# Altium schematic sheet CanFD.SchDoc: CanFD Components
size A4; ApprovedBy: Diogo Gomes; CheckedBy: Bruno, Candido, Pedro; Author: João Vieira; CompanyName: LART; DrawnBy: João Vieira; Organization: LART; Address1: Morro do lena; Address2: Alto Do Vieiro; Address3: APT 4163, Building D; Revision: v1.4.2; SheetNumber: 5; SheetTotal: 7; ProjectTitle: Autonomous Control Unit; CheckedBy1: G. Candido; CheckedBy2: F. Chen; CheckedBy3: P. Ferreira; CheckedBy4: B. Vicente; CheckedBy5: _; CheckedBy6: _; CheckedBy7: _; CHK_APP_DATE: --/--/--; DSN_APP_DATE: --/--/--; ENG_APP_DATE: --/--/--; Summary: Various CAN FD components; version_tag: 1.4.2; ImagePath: C:\Users\micron\Desktop
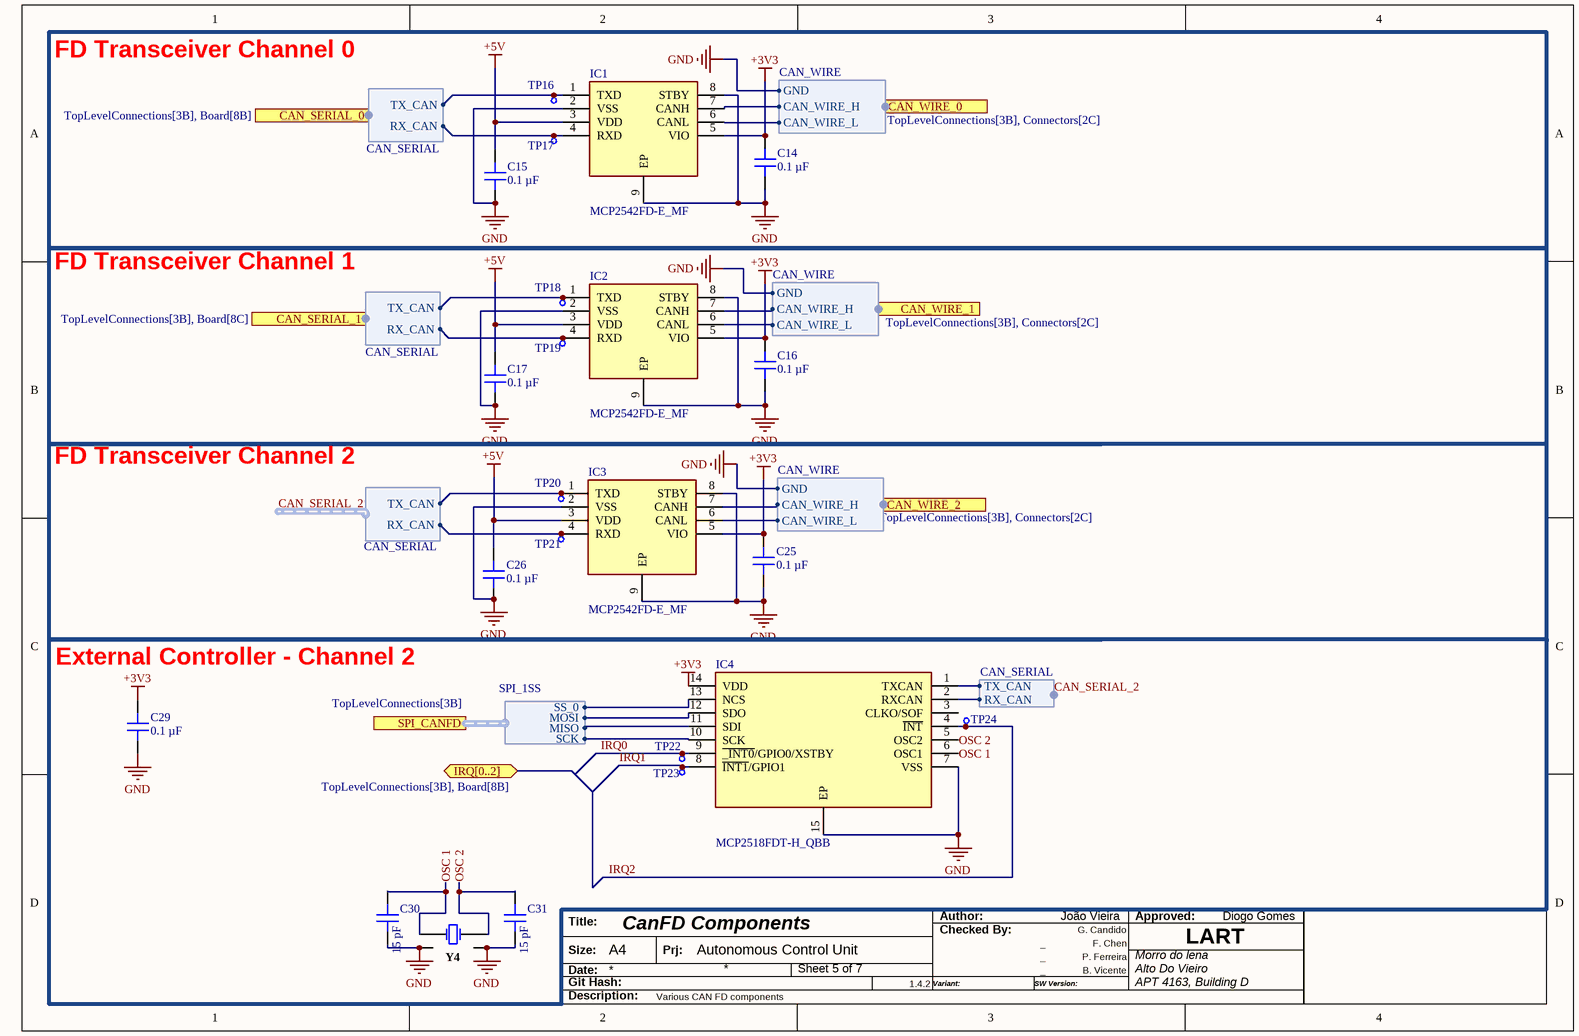
[diagram p0: CanFD.SchDoc]

## Parts
C14  value 0.1 µF  [CAP 0805_2012]  (hidden comment: 0.1uF)
C15  value 0.1 µF  [CAP 0805_2012]  (hidden comment: 0.1uF)
C16  value 0.1 µF  [CAP 0805_2012]  (hidden comment: 0.1uF)
C17  value 0.1 µF  [CAP 0805_2012]  (hidden comment: 0.1uF)
C25  value 0.1 µF  [CAP 0805_2012]  (hidden comment: 0.1uF)
C26  value 0.1 µF  [CAP 0805_2012]  (hidden comment: 0.1uF)
C29  0.1 µF  [CAP 0805_2012]
C30  15 pF  [CAP 0805_2012]
C31  15 pF  [CAP 0805_2012]
IC1  MCP2542FD-E_MF  [SON65P300X300X100-9N-D]
IC2  MCP2542FD-E_MF  [SON65P300X300X100-9N-D]
IC3  MCP2542FD-E_MF  [SON65P300X300X100-9N-D]
IC4  MCP2518FDT-H_QBB  [SON65P300X450X90-15N-D]
TP16  TestPad  [Test Pad Small]  (value not drawn)
TP17  TestPad  [Test Pad Small]  (value not drawn)
TP18  TestPad  [Test Pad Small]  (value not drawn)
TP19  TestPad  [Test Pad Small]  (value not drawn)
TP20  TestPad  [Test Pad Small]  (value not drawn)
TP21  TestPad  [Test Pad Small]  (value not drawn)
TP22  TestPad  [Test Pad Small]  (value not drawn)
TP23  TestPad  [Test Pad Small]  (value not drawn)
TP24  TestPad  [Test Pad Small]  (value not drawn)
Y4  ABM8-20.000MHZ-10-1-U-T  [FP-ABM8-MFG]  (value not drawn)

## Blocks framed on the sheet
FD Transceiver Channel 0: C14 C15 IC1 TP16 TP17
External Controller - Channel 2: C29-C31 IC4 TP22-TP24 Y4

## Ports
CAN_SERIAL_0 (harness CAN_SERIAL, see TopLevelConnections[3B], Board[8B]), CAN_SERIAL_1 (harness CAN_SERIAL, see TopLevelConnections[3B], Board[8C]), CAN_WIRE_0 (harness CAN_WIRE, see TopLevelConnections[3B], Connectors[2C]), CAN_WIRE_1 (harness CAN_WIRE, see TopLevelConnections[3B], Connectors[2C]), CAN_WIRE_2 (harness CAN_WIRE, see TopLevelConnections[3B], Connectors[2C]), IRQ[0..2] (bidir, see TopLevelConnections[3B], Board[8B]), SPI_CANFD (harness SPI_1SS, see TopLevelConnections[3B])

## Harnesses
CAN_SERIAL: RX_CAN, TX_CAN
CAN_WIRE: GND, CAN_WIRE_H, CAN_WIRE_L
SPI_1SS: MOSI, MISO, SS_0, SCK

## Nets
+3V3: C14.2 C16.2 C25.2 C29.2 IC1.5(VIO) IC2.5(VIO) IC3.5(VIO) IC4.14(VDD)
+5V: C15.2 C17.2 C26.2 IC1.3(VDD) IC2.3(VDD) IC3.3(VDD)
GND: C14.1 C15.1 C16.1 C17.1 C25.1 C26.1 C29.1 C30.1 C31.1 IC1.2(VSS) IC1.8(STBY) IC1.9(EP) IC2.2(VSS) IC2.8(STBY) IC2.9(EP) IC3.2(VSS) IC3.8(STBY) IC3.9(EP) IC4.7(VSS) IC4.15(EP) Y4.3 Y4.4 ; port CAN_WIRE_0.GND, port CAN_WIRE_1.GND, port CAN_WIRE_2.GND
CAN_SERIAL_2.RX_CAN: IC3.4(RXD) IC4.2(RXCAN) TP21.P2 ; harness CAN_SERIAL.RX_CAN
CAN_SERIAL_2.TX_CAN: IC3.1(TXD) IC4.1(TXCAN) TP20.P2 ; harness CAN_SERIAL.TX_CAN
IRQ0: IC4.9(~{_INT0}/GPIO0/XSTBY) TP22.P2
IRQ1: IC4.8(~{INT1}/GPIO1) TP23.P2
IRQ2: IC4.4(~{INT}) TP24.P2
OSC 1: C30.2 IC4.6(OSC1) Y4.1
OSC 2: C31.2 IC4.5(OSC2) Y4.2
NetIC1_1: IC1.1(TXD) TP16.P2 ; port CAN_SERIAL_0.TX_CAN
NetIC1_4: IC1.4(RXD) TP17.P2 ; port CAN_SERIAL_0.RX_CAN
NetIC1_6: IC1.6(CANL) ; port CAN_WIRE_0.CAN_WIRE_L
NetIC1_7: IC1.7(CANH) ; port CAN_WIRE_0.CAN_WIRE_H
NetIC2_1: IC2.1(TXD) TP18.P2 ; port CAN_SERIAL_1.TX_CAN
NetIC2_4: IC2.4(RXD) TP19.P2 ; port CAN_SERIAL_1.RX_CAN
NetIC2_6: IC2.6(CANL) ; port CAN_WIRE_1.CAN_WIRE_L
NetIC2_7: IC2.7(CANH) ; port CAN_WIRE_1.CAN_WIRE_H
NetIC3_6: IC3.6(CANL) ; port CAN_WIRE_2.CAN_WIRE_L
NetIC3_7: IC3.7(CANH) ; port CAN_WIRE_2.CAN_WIRE_H
NetIC4_10: IC4.10(SCK) ; port SPI_CANFD.SCK
NetIC4_11: IC4.11(SDI) ; port SPI_CANFD.MISO
NetIC4_12: IC4.12(SDO) ; port SPI_CANFD.MOSI
NetIC4_13: IC4.13(NCS) ; port SPI_CANFD.SS_0

Not connected (* = marked no-connect by the designer): IC4 3(CLKO/SOF)

## Notes on the sheet
- FD Transceiver Channel 1
- FD Transceiver Channel 2
- Title:
- Author:
- Checked By:
- Approved:
- Size:
- Date:
- Git Hash:
- A4
- Prj:
- Variant:
- SW Version:
- Description:

## Library data of the parts
C14-C17 C25 C26 = CC0805MRX7R9BB104: CAP CER 0.1UF 50V X7R 0805; manufacturer: Yageo; Tolerance: ±20%; Part Number: CC0805MRX7R9BB104; Applications: General Purpose; Capacitance: 0.1 µF; componentlink1description: Datasheet; componentlink1url: https://www.yageo.com/upload/media/product/productsearch/datasheet/mlcc/UPY-GPHC_X7R_6.3V-to-50V_18.pdf; componentlink2description: DigiKey Link; componentlink2url: https://www.digikey.com/en/products/detail/yageo/CC0805MRX7R9BB104/5884281; Device Package: 0805 (2012 Metric); lastupdated: 09/02/2024 20:16:09; Lifecycle Status: Active; Minimum Order: 1; Mounting Type: Surface Mount, MLCC; Operating Temperature: -55°C ~ 125°C; Package / Case: 0805 (2012 Metric); packaging: TapeAndReel; partid: 2475; Part Status: Active; price: 0.01; series: CC; Size / Dimension: 0.079" L x 0.049" W (2.00mm x 1.25mm); Supplier 1: DigiKey; Supplier Part Number 1: 311-4351-1-ND; Temperature Coefficient: X7R; Thickness (Max): 0.037" (0.95mm); Voltage - Rated: 50V
C29 = VJ0805Y104MXAMR: CAP CER 0.1UF 50V X7R 0805; manufacturer: Vishay Vitramon; Tolerance: ±20%; Part Number: VJ0805Y104MXAMR; Value: 0.1 µF; Applications: General Purpose; Capacitance: 0.1 µF; componentlink1description: Datasheet; componentlink1url: http://www.vishay.com/docs/45199/vjcommercialseries.pdf; componentlink2description: DigiKey Link; componentlink2url: https://www.digikey.com/en/products/detail/vishay-vitramon/VJ0805Y104MXAMR/8311084; Device Package: 0805 (2012 Metric); lastupdated: 04/02/2024 20:15:56; Lifecycle Status: Active; Minimum Order: 1; Mounting Type: Surface Mount, MLCC; Operating Temperature: -55°C ~ 150°C; Package / Case: 0805 (2012 Metric); packaging: TapeAndReel; partid: 14439; Part Status: Active; price: 0.09; series: VJ; Size / Dimension: 0.079" L x 0.049" W (2.00mm x 1.25mm); Supplier 1: DigiKey; Supplier Part Number 1: 720-1755-1-ND; Temperature Coefficient: X7R; Thickness (Max): 0.057" (1.45mm); Voltage - Rated: 50V
C30 C31 = VJ0805D150JXPQJHT: CAP CER 15PF 250V C0G/NP0 0805; manufacturer: Vishay Vitramon; Temperature Coefficient: C0G, NP0; Tolerance: ±5%; Part Number: VJ0805D150JXPQJHT; Value: 15 pF; Applications: RF, Microwave, High Frequency; Capacitance: 15 pF; componentlink1description: Datasheet; componentlink1url: https://www.vishay.com/docs/45239/vjhifreqht.pdf; componentlink2description: DigiKey Link; componentlink2url: https://www.digikey.com/en/products/detail/vishay-vitramon/VJ0805D150JXPQJHT/14292748; Device Package: 0805 (2012 Metric); Features: High Temperature; lastupdated: 04/02/2024 20:15:19; Lifecycle Status: Active; Minimum Order: 1; Mounting Type: Surface Mount, MLCC; Operating Temperature: -55°C ~ 200°C; Package / Case: 0805 (2012 Metric); packaging: TapeAndReel; partid: 31685; Part Status: Active; price: 0.11; series: VJ HIFREQ HT; Size / Dimension: 0.079" L x 0.049" W (2.00mm x 1.25mm); Supplier 1: DigiKey; Supplier Part Number 1: 720-VJ0805D150JXPQJHTCT-ND; Thickness (Max): 0.057" (1.45mm); Voltage - Rated: 250V
IC1-IC3 = MCP2542FD-E_MF: Integrated Circuit; Manufacturer_Name: Microchip; Manufacturer_Part_Number: MCP2542FD-E/MF; Datasheet Link: http://ww1.microchip.com/downloads/en/devicedoc/20005514a.pdf; Height: 1mm; Mouser Part Number: 579-MCP2542FD-E/MF; Mouser Price/Stock: https://www.mouser.co.uk/ProductDetail/Microchip-Technology-Atmel/MCP2542FD-E-MF?qs=l7cgNqFNU1jog4BwTzULBw%3D%3D; Arrow Part Number: MCP2542FD-E/MF; Arrow Price/Stock: https://www.arrow.com/en/products/mcp2542fd-emf/microchip-technology?region=nac
IC4 = MCP2518FDT-H_QBB: Integrated Circuit; Manufacturer_Name: Microchip; Manufacturer_Part_Number: MCP2518FDT-H/QBB; Datasheet Link: https://www.mouser.in/datasheet/2/268/MCP2518FD-Data-Sheet-20006027A-1596921.pdf; Height: 0.9mm; Mouser Part Number: 579-MCP2518FDT-H/QBB; Mouser Price/Stock: https://www.mouser.co.uk/ProductDetail/Microchip-Technology/MCP2518FDT-H-QBB?qs=T3oQrply3y8bDZ20CsIcGQ%3D%3D; Arrow Part Number: MCP2518FDT-H/QBB; Arrow Price/Stock: https://www.arrow.com/en/products/mcp2518fdt-hqbb/microchip-technology?region=nac
Y4 = CMP-003-00030-2: Crystal 20MHz ±10ppm (Tol) ±10ppm (Stability) 10pF FUND 50Ohm 4-Pin Ultra Mini-CSMD T/R